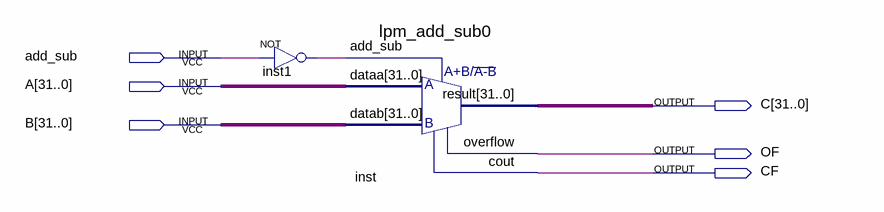
[diagram p0: schematic sheet]
// Quartus schematic add_sub.bdf as structural Verilog: 2 symbols, 6 pins
module add_sub (
  input  add_sub,
  input  [31:0] A,
  input  [31:0] B,
  output [31:0] C,
  output OF,
  output CF
);

  wire inst1_out;

  not inst1 (inst1_out, add_sub);
  lpm_add_sub0 inst (.dataa(A), .datab(B), .add_sub(inst1_out), .result(C), .overflow(OF), .cout(CF));
endmodule
